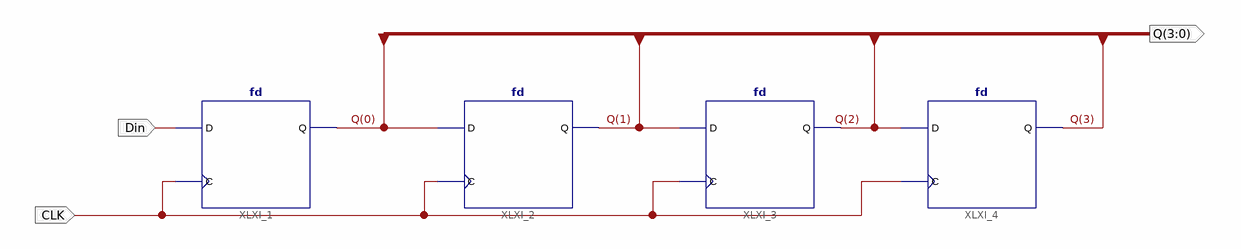
[diagram p0: schematic sheet 1]
// Xilinx ISE schematic Lab7_Exp6.sch (spartan3e) as structural Verilog: 4 symbols, 3 ports
module Lab7_Exp6 (
  input  CLK,
  input  Din,
  output [3:0] Q
);

  fd XLXI_1 (.C(CLK), .D(Din), .Q(Q[0]));
  fd XLXI_2 (.C(CLK), .D(Q[0]), .Q(Q[1]));
  fd XLXI_3 (.C(CLK), .D(Q[1]), .Q(Q[2]));
  fd XLXI_4 (.C(CLK), .D(Q[2]), .Q(Q[3]));
endmodule
